# Altium schematic sheet AD.SchDoc
size A1
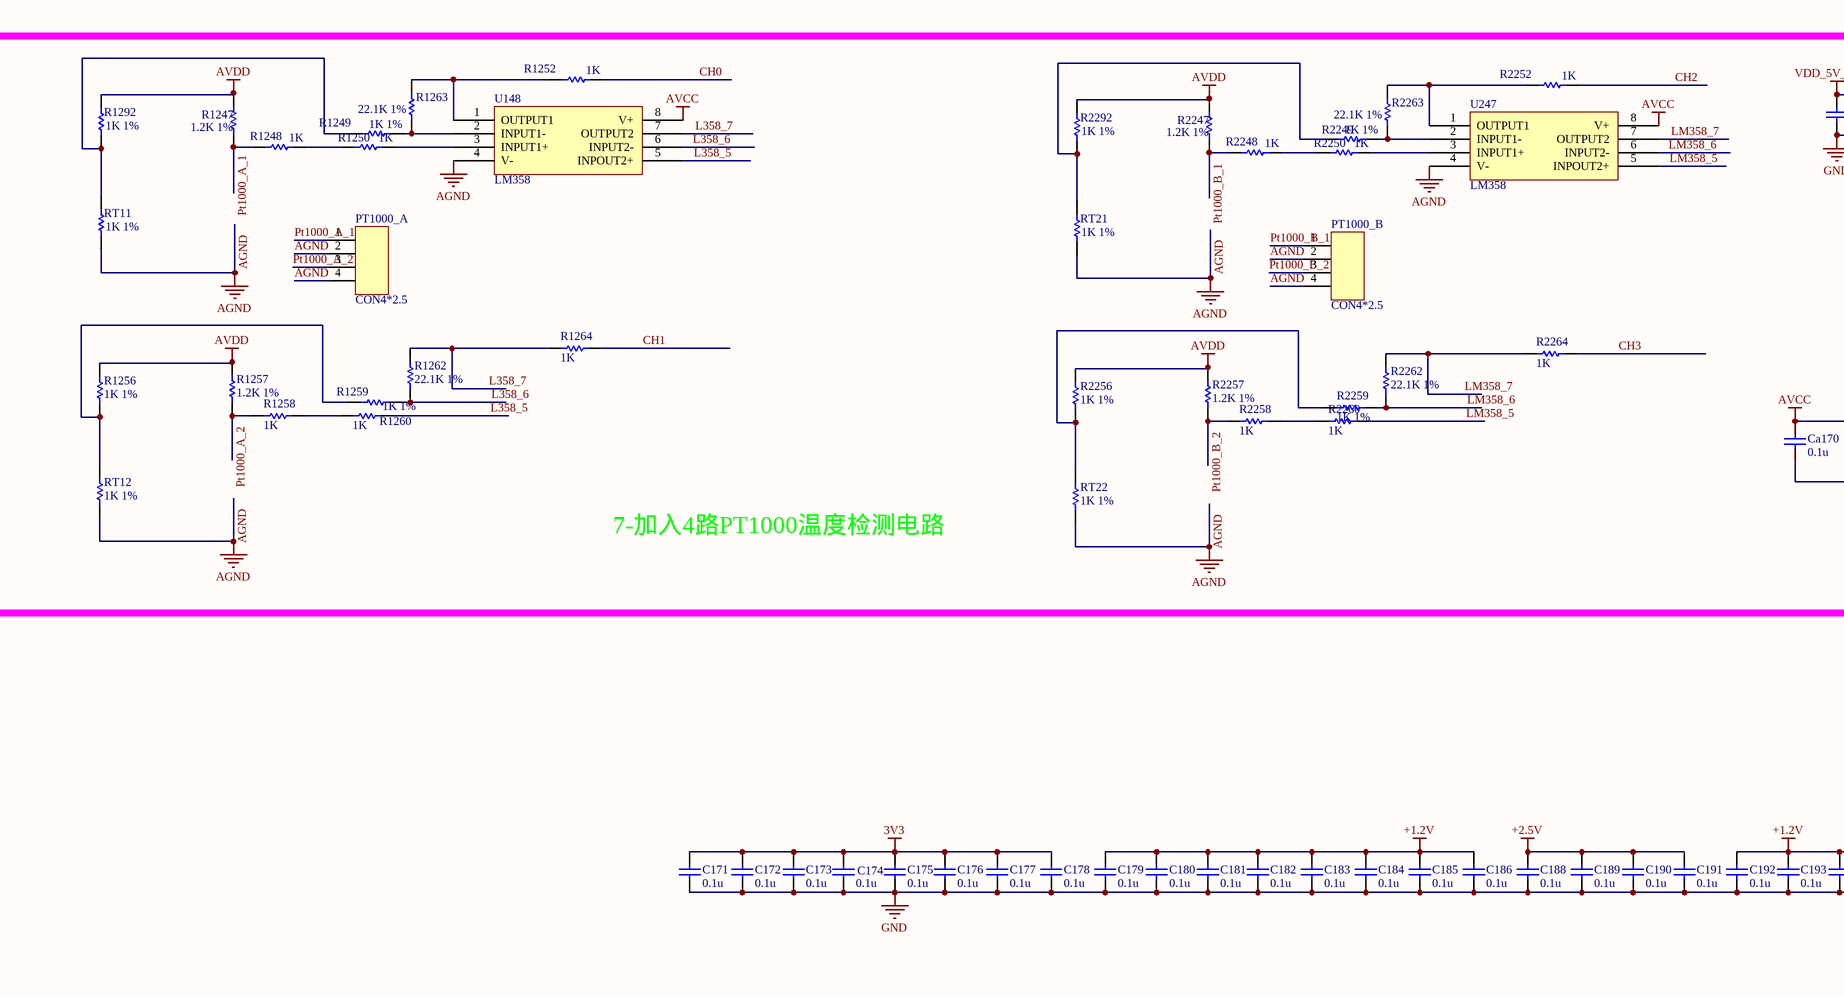
[diagram p0: AD.SchDoc, top left]
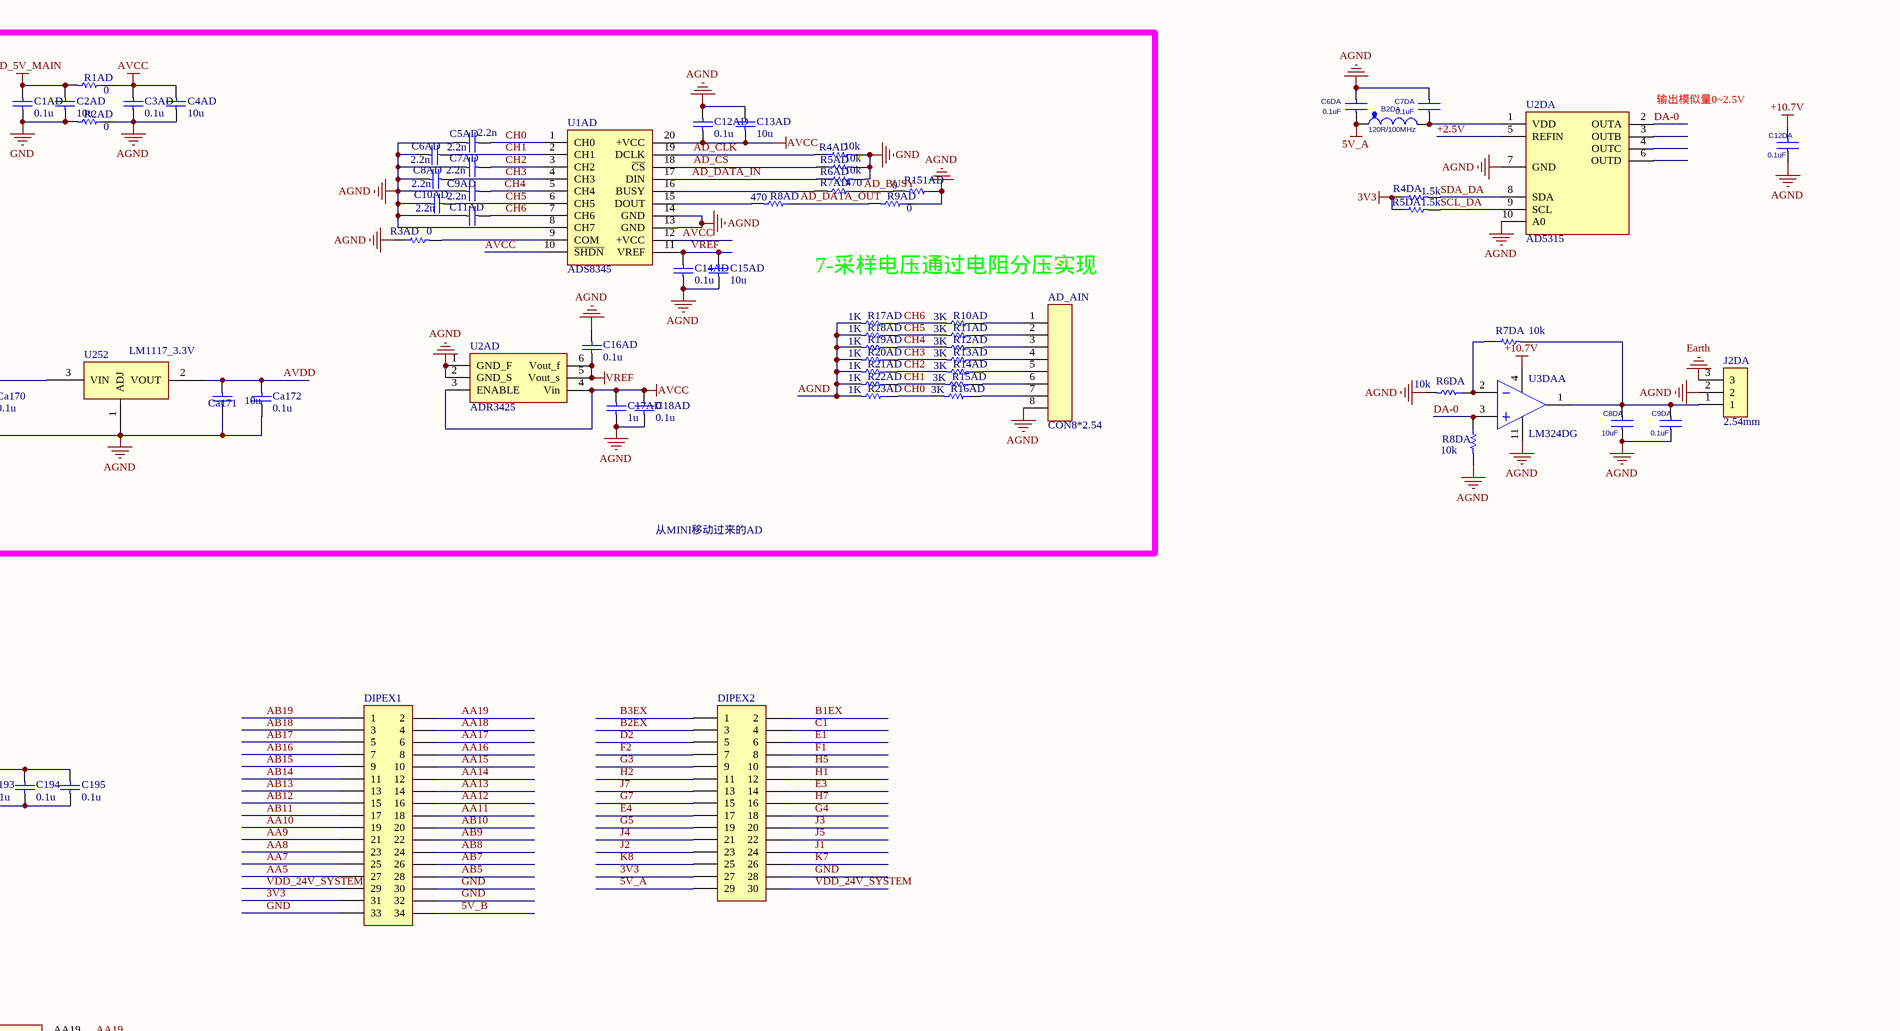
[diagram p1: AD.SchDoc, top right]
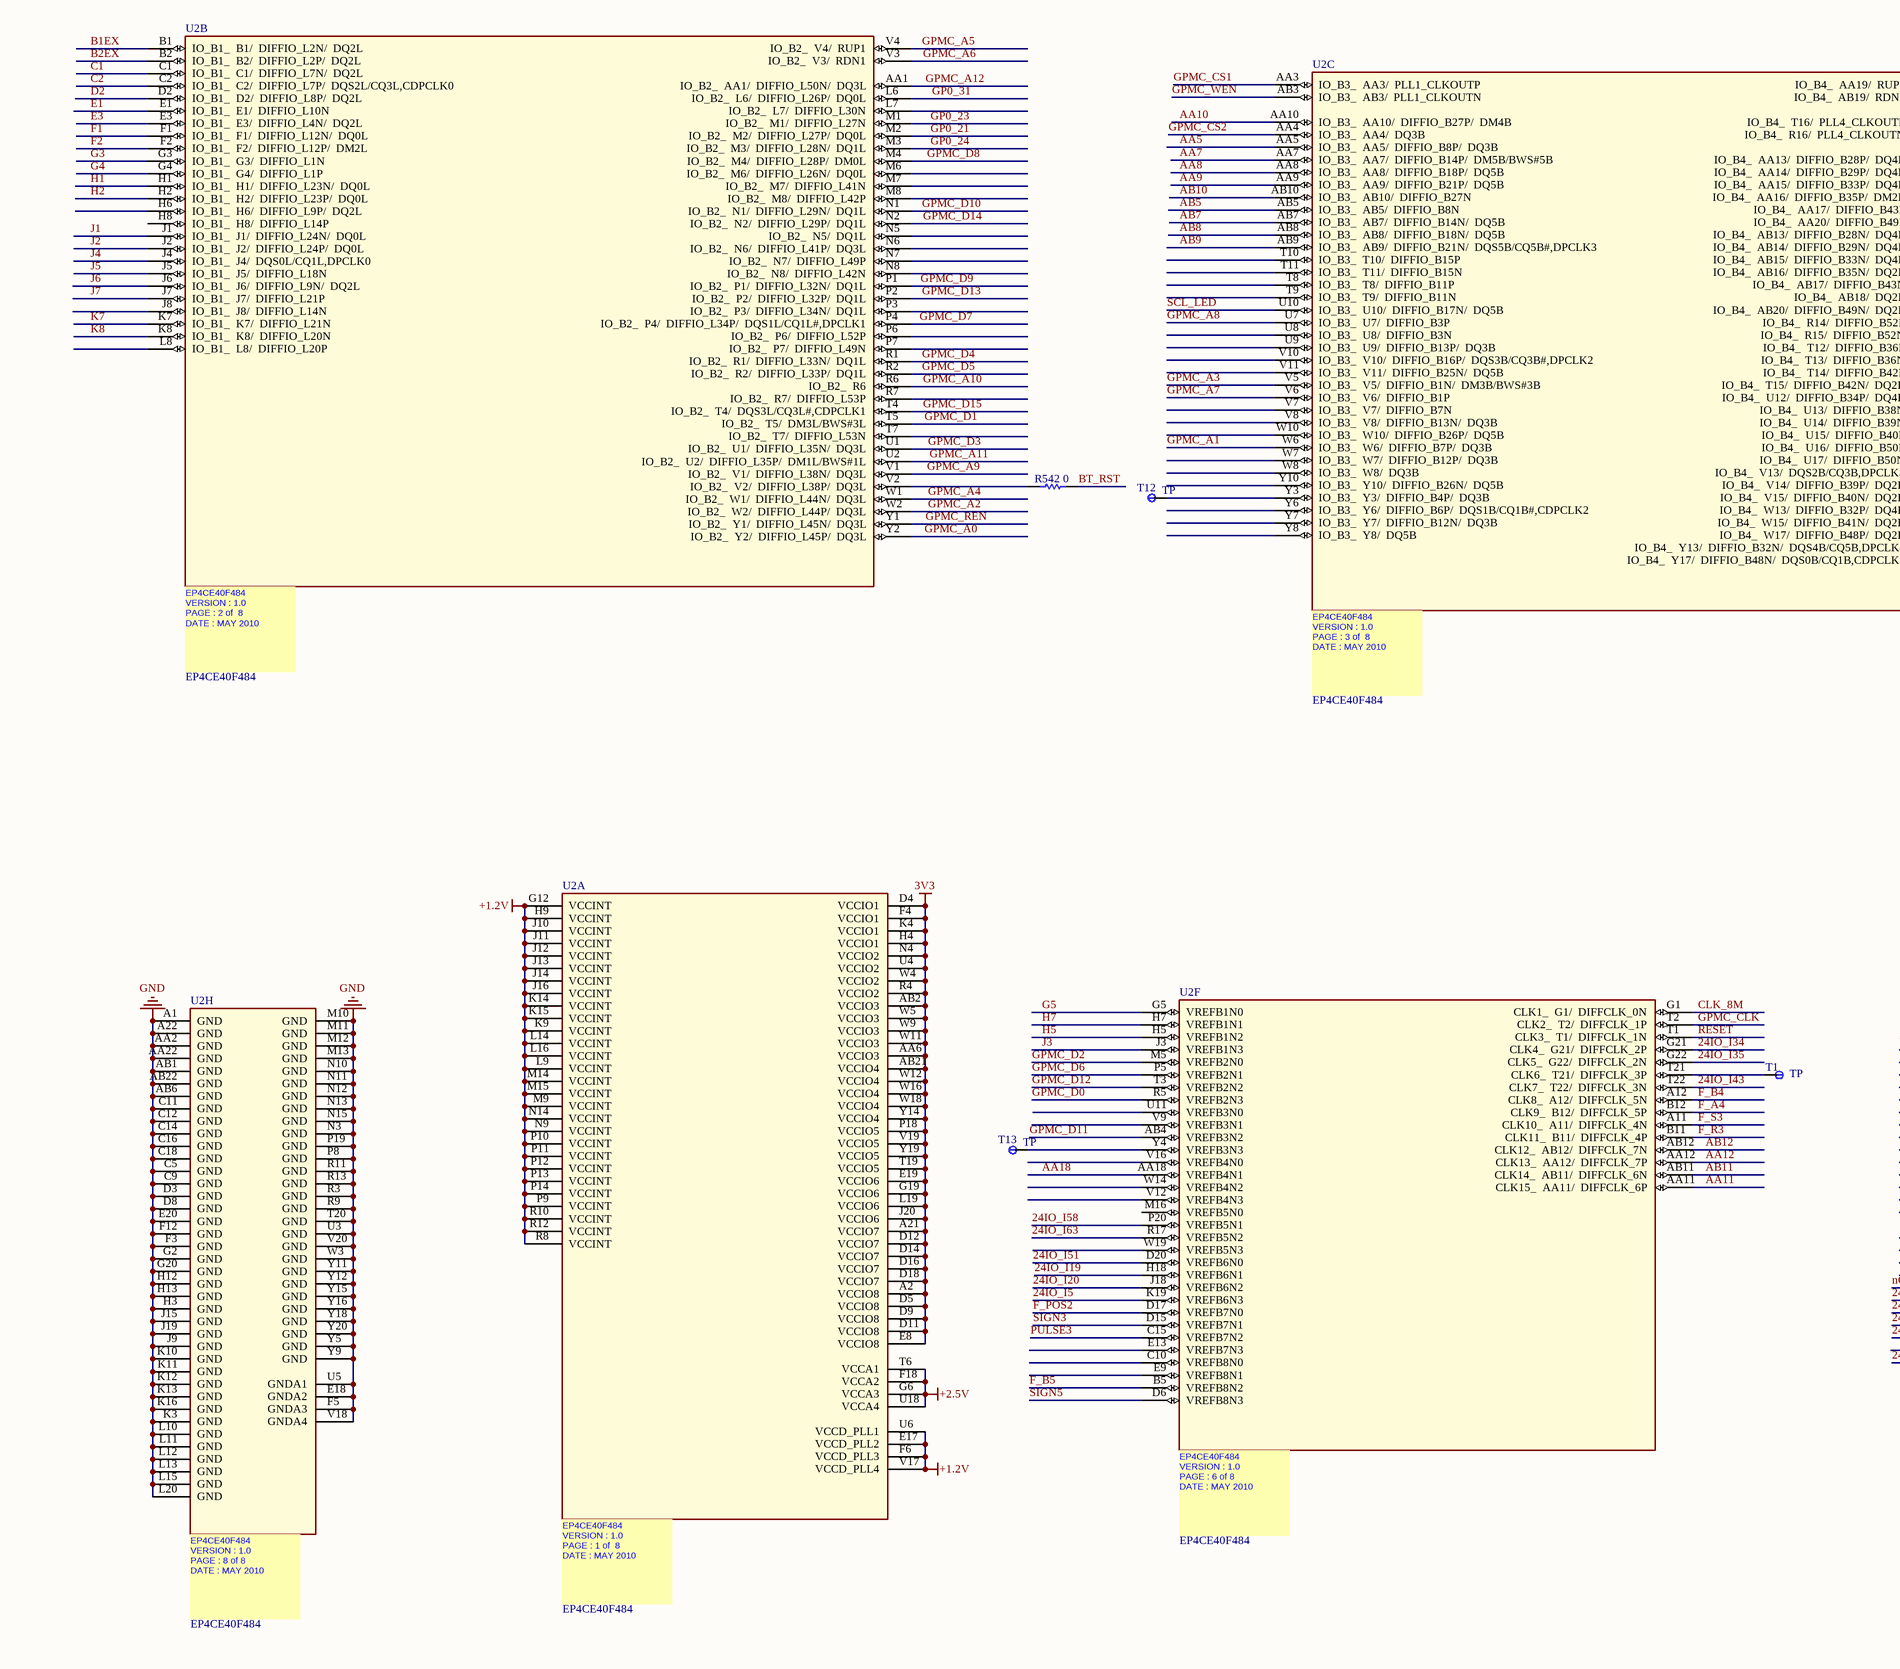
[diagram p2: AD.SchDoc, bottom left]
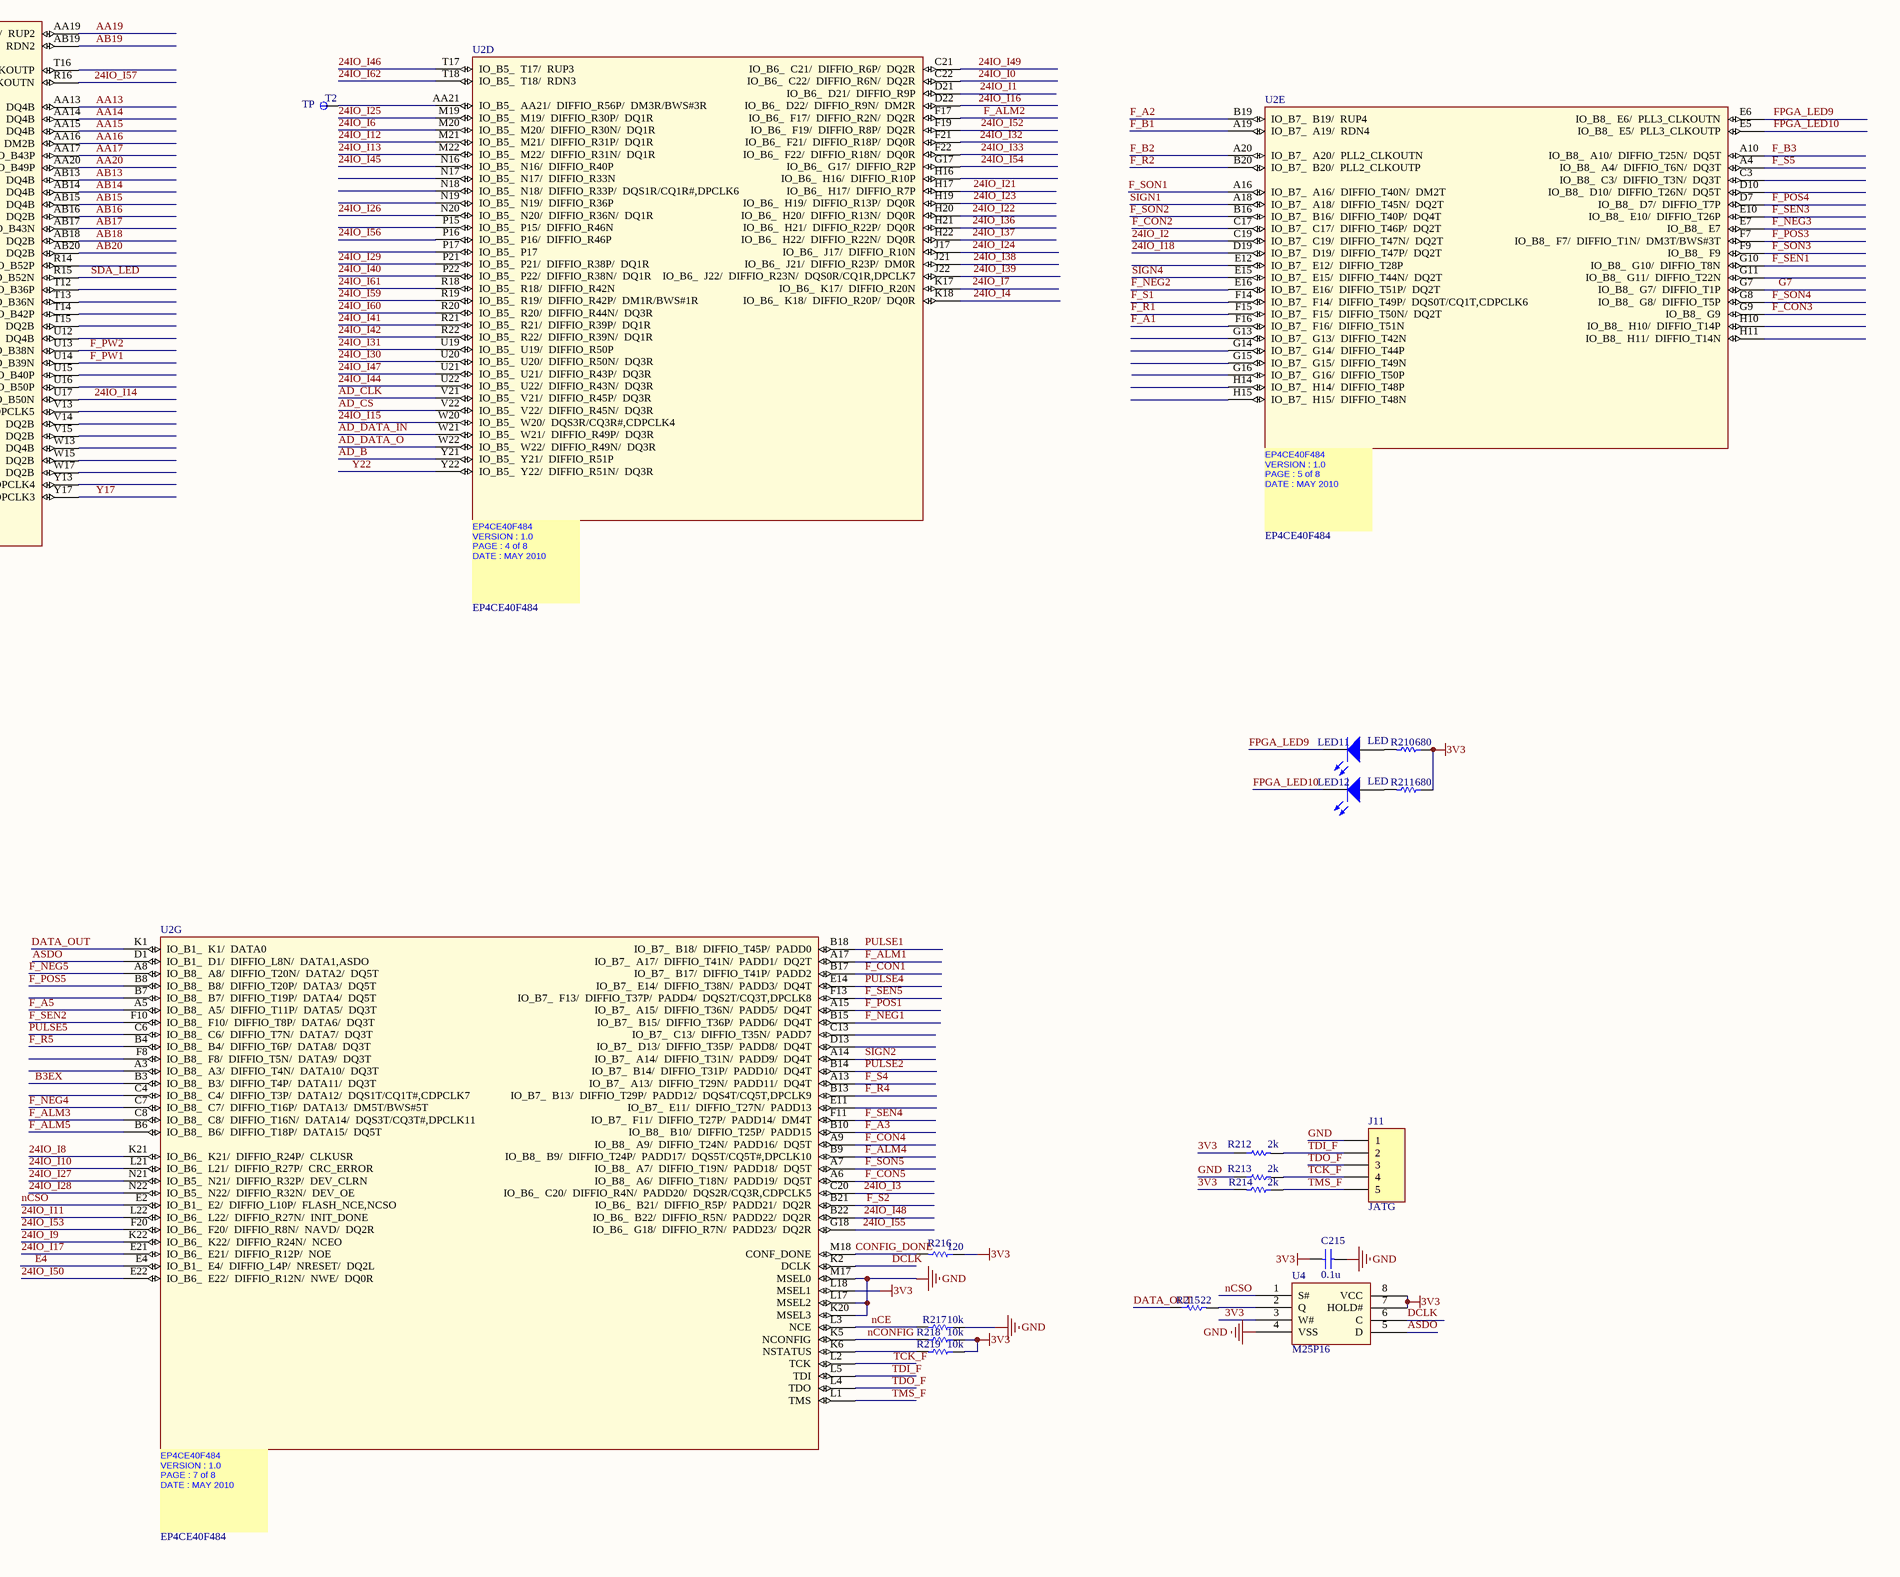
[diagram p3: AD.SchDoc, bottom right]

## Parts
AD_AIN  CON8*2.54  [CON2.54mm*8]
B2DA  120R/100MHz  [R0603]
C1AD  0.1u  [0402]
C2AD  10u  [C0805]
C3AD  0.1u  [0402]
C4AD  10u  [C0805]
C5AD  2.2n  [C0603]
C6AD  2.2n  [C0603]
C6DA  0.1uF  [C0603]
C7AD  2.2n  [C0603]
C7DA  0.1uF  [C0603]
C8AD  2.2n  [C0603]
C8DA  10uF  [C0805]
C9AD  2.2n  [C0603]
C9DA  0.1uF  [C0603]
C10AD  2.2n  [C0603]
C11AD  2.2n  [C0603]
C12AD  0.1u  [0402]
C12DA  0.1uF  [C0603]
C13AD  10u  [C0805]
C14AD  0.1u  [0402]
C15AD  10u  [C0805]
C16AD  0.1u  [0402]
C17AD  1u  [C0603]
C18AD  0.1u  [0402]
C171  0.1u  [C0402]
C172  0.1u  [C0402]
C173  0.1u  [C0402]
C174  0.1u  [C0402]
C175  0.1u  [C0402]
C176  0.1u  [C0402]
C177  0.1u  [C0402]
C178  0.1u  [C0402]
C179  0.1u  [C0402]
C180  0.1u  [C0402]
C181  0.1u  [C0402]
C182  0.1u  [C0402]
C183  0.1u  [C0402]
C184  0.1u  [C0402]
C185  0.1u  [C0402]
C186  0.1u  [C0402]
C188  0.1u  [C0402]
C189  0.1u  [C0402]
C190  0.1u  [C0402]
C191  0.1u  [C0402]
C192  0.1u  [C0402]
C193  0.1u  [C0402]
C194  0.1u  [C0402]
C195  0.1u  [C0402]
C215  0.1u  [C0402]
Ca170  0.1u  [C0603]
Ca171  10u  [C0805]
Ca172  0.1u  [C0603]
DIPEX1  (no value)  [HDR2X17]
DIPEX2  (no value)  [HDR2X15]
J2DA  2.54mm  [CON2.54MM*3]
J11  JATG  [MHDR1X5]
LED11  LED  [LED0603]
LED12  LED  [LED0603]
PT1000_A  CON4*2.5  [CON2.54MM*4]
PT1000_B  CON4*2.5  [CON2.54MM*4]
R1AD  0  [C0603]
R2AD  0  [C0603]
R3AD  0  [0402]
R4AD  10k  [0402]
R4DA  1.5k  [R0603]
R5AD  10k  [0402]
R5DA  1.5k  [R0603]
R6AD  10k  [0402]
R6DA  10k  [R0603]
R7AD  470  [0402]
R7DA  10k  [R0603]
R8AD  470  [0402]
R8DA  10k  [R0603]
R9AD  0  [R0603]
R10AD  3K  [0402]
R11AD  3K  [0402]
R12AD  3K  [0402]
R13AD  3K  [0402]
R14AD  3K  [0402]
R15AD  3K  [0402]
R16AD  3K  [0402]
R17AD  1K  [0402]
R18AD  1K  [0402]
R19AD  1K  [0402]
R20AD  1K  [0402]
R21AD  1K  [0402]
R22AD  1K  [0402]
R23AD  1K  [0402]
R151AD  0  [R0603]
R210  680  [R0603]
R211  680  [R0603]
R212  2k  [R0603]
R213  2k  [R0603]
R214  2k  [R0603]
R215  22  [R0603]
R216  120  [R0603]
R217  10k  [R0603]
R218  10k  [R0603]
R219  10k  [R0603]
R542  0  [R0603]
R1247  1.2K 1%  [R0603]
R1248  1K  [R0603]
R1249  1K 1%  [R0603]
R1250  1K  [R0603]
R1252  1K  [R0603]
R1256  1K 1%  [R0603]
R1257  1.2K 1%  [R0603]
R1258  1K  [R0603]
R1259  1K 1%  [R0603]
R1260  1K  [R0603]
R1262  22.1K 1%  [R0603]
R1263  22.1K 1%  [R0603]
R1264  1K  [R0603]
R1292  1K 1%  [R0603]
R2247  1.2K 1%  [R0603]
R2248  1K  [R0603]
R2249  1K 1%  [R0603]
R2250  1K  [R0603]
R2252  1K  [R0603]
R2256  1K 1%  [R0603]
R2257  1.2K 1%  [R0603]
R2258  1K  [R0603]
R2259  1K 1%  [R0603]
R2260  1K  [R0603]
R2262  22.1K 1%  [R0603]
R2263  22.1K 1%  [R0603]
R2264  1K  [R0603]
R2292  1K 1%  [R0603]
RT11  1K 1%  [R0603]
RT12  1K 1%  [R0603]
RT21  1K 1%  [R0603]
RT22  1K 1%  [R0603]
T1  TP  [TP]
T2  TP  [TP]
T12  TP  [TP]
T13  TP  [TP]
U1AD  ADS8345  [TSSOP20]
U2  EP4CE40F484  [F484]  (parts A,B,C,D,E,F,G,H of 8)
U2AD  ADR3425  [SOT-23-6]
U2DA  AD5315  [MSOP]
U3DA  LM324DG  [SO-14]  (part A of 4)
U4  M25P16  [SO-G8]
U148  LM358  [SO-G8]
U247  LM358  [SO-G8]
U252  LM1117_3.3V  [SOT223]

## Nets
3V3: C171.2 C172.2 C173.2 C174.2 C175.2 C176.2 C177.2 C178.2 C215.2 DIPEX1.31 DIPEX2.27 R4DA.1 R5DA.1 R210.1 R211.1 R212.1 R214.2 R216.1 R218.1 R219.1 U2.A2(VCCIO8) U2.A21(VCCIO7) U2.AA6(VCCIO3) U2.AB2(VCCIO3) U2.AB21(VCCIO4) U2.D4(VCCIO1) U2.D5(VCCIO8) U2.D9(VCCIO8) U2.D11(VCCIO8) U2.D12(VCCIO7) U2.D14(VCCIO7) U2.D16(VCCIO7) U2.D18(VCCIO7) U2.E8(VCCIO8) U2.E19(VCCIO6) U2.F4(VCCIO1) U2.G19(VCCIO6) U2.H4(VCCIO1) U2.J20(VCCIO6) U2.K4(VCCIO1) U2.L18(MSEL1) U2.L19(VCCIO6) U2.N4(VCCIO2) U2.P18(VCCIO5) U2.R4(VCCIO2) U2.T19(VCCIO5) U2.U4(VCCIO2) U2.V19(VCCIO5) U2.W4(VCCIO2) U2.W5(VCCIO3) U2.W9(VCCIO3) U2.W11(VCCIO3) U2.W12(VCCIO4) U2.W16(VCCIO4) U2.W18(VCCIO4) U2.Y14(VCCIO4) U2.Y19(VCCIO5) U4.3(W#) U4.7(HOLD#) U4.8(VCC)
5V_A: B2DA.1 C6DA.1 DIPEX2.29
+1.2V: C179.2 C180.2 C181.2 C182.2 C183.2 C184.2 C185.2 C186.2 C192.2 C193.2 C194.2 C195.2 U2.E17(VCCD_PLL2) U2.F6(VCCD_PLL3) U2.G12(VCCINT) U2.H9(VCCINT) U2.J10(VCCINT) U2.J11(VCCINT) U2.J12(VCCINT) U2.J13(VCCINT) U2.J14(VCCINT) U2.J16(VCCINT) U2.K9(VCCINT) U2.K14(VCCINT) U2.K15(VCCINT) U2.L9(VCCINT) U2.L14(VCCINT) U2.L16(VCCINT) U2.M9(VCCINT) U2.M14(VCCINT) U2.M15(VCCINT) U2.N9(VCCINT) U2.N14(VCCINT) U2.P9(VCCINT) U2.P10(VCCINT) U2.P11(VCCINT) U2.P12(VCCINT) U2.P13(VCCINT) U2.P14(VCCINT) U2.R8(VCCINT) U2.R10(VCCINT) U2.R12(VCCINT) U2.U6(VCCD_PLL1) U2.V17(VCCD_PLL4)
+2.5V: C188.2 C189.2 C190.2 C191.2 U2.F18(VCCA2) U2.G6(VCCA3) U2.T6(VCCA1) U2.U18(VCCA4) U2DA.5(REFIN)
+10.7V: C12DA.2 U3DA.4(VDD)
AGND: AD_AIN.8 C3AD.1 C4AD.1 C5AD.2 C6AD.2 C6DA.2 C7AD.2 C7DA.2 C8AD.2 C8DA.1 C9AD.2 C9DA.1 C10AD.2 C11AD.2 C12AD.2 C12DA.1 C13AD.2 C14AD.1 C15AD.1 C16AD.1 C17AD.2 C18AD.2 Ca170.1 Ca171.1 Ca172.1 J2DA.2 PT1000_A.2 PT1000_A.4 PT1000_B.2 PT1000_B.4 R2AD.1 R3AD.1 R6DA.2 R8DA.2 R9AD.1 R17AD.2 R18AD.2 R19AD.2 R20AD.2 R21AD.2 R22AD.2 R23AD.2 R151AD.1 RT11.2 RT12.2 RT21.2 RT22.2 U1AD.8(CH7) U1AD.13(GND) U1AD.14(GND) U2AD.1(GND_F) U2AD.2(GND_S) U2DA.7(GND) U2DA.10(A0) U3DA.11(GND) U148.4(V-) U247.4(V-) U252.1(ADJ)
AVCC: C3AD.2 C4AD.2 C12AD.1 C13AD.1 C17AD.1 C18AD.1 Ca170.2 R1AD.1 U1AD.10(~{SHDN}) U1AD.12(+VCC) U1AD.20(+VCC) U2AD.3(ENABLE) U2AD.4(Vin) U148.8(V+) U247.8(V+) U252.3(VIN)
AVDD: Ca171.2 Ca172.2 R1247.1 R1256.1 R1257.1 R1292.1 R2247.1 R2256.1 R2257.1 R2292.1 U252.2(VOUT)
Earth: J2DA.3
GND: C1AD.1 C2AD.1 C171.1 C172.1 C173.1 C174.1 C175.1 C176.1 C177.1 C178.1 C179.1 C180.1 C181.1 C182.1 C183.1 C184.1 C185.1 C186.1 C188.1 C189.1 C190.1 C191.1 C192.1 C193.1 C194.1 C195.1 C215.1 DIPEX1.30 DIPEX1.32 DIPEX1.33 DIPEX2.28 J11.1 R2AD.2 R4AD.2 R5AD.2 R6AD.2 R213.1 R217.1 U2.A1(GND) U2.A22(GND) U2.AA2(GND) U2.AA22(GND) U2.AB1(GND) U2.AB6(GND) U2.AB22(GND) U2.C5(GND) U2.C9(GND) U2.C11(GND) U2.C12(GND) U2.C14(GND) U2.C16(GND) U2.C18(GND) U2.D3(GND) U2.D8(GND) U2.E18(GNDA2) U2.E20(GND) U2.F3(GND) U2.F5(GNDA3) U2.F12(GND) U2.G2(GND) U2.G20(GND) U2.H3(GND) U2.H12(GND) U2.H13(GND) U2.J9(GND) U2.J15(GND) U2.J19(GND) U2.K3(GND) U2.K10(GND) U2.K11(GND) U2.K12(GND) U2.K13(GND) U2.K16(GND) U2.K20(MSEL3) U2.L10(GND) U2.L11(GND) U2.L12(GND) U2.L13(GND) U2.L15(GND) U2.L17(MSEL2) U2.L20(GND) U2.M10(GND) U2.M11(GND) U2.M12(GND) U2.M13(GND) U2.M17(MSEL0) U2.N3(GND) U2.N10(GND) U2.N11(GND) U2.N12(GND) U2.N13(GND) U2.N15(GND) U2.P8(GND) U2.P19(GND) U2.R3(GND) U2.R9(GND) U2.R11(GND) U2.R13(GND) U2.T20(GND) U2.U3(GND) U2.U5(GNDA1) U2.V18(GNDA4) U2.V20(GND) U2.W3(GND) U2.Y5(GND) U2.Y9(GND) U2.Y11(GND) U2.Y12(GND) U2.Y15(GND) U2.Y16(GND) U2.Y18(GND) U2.Y20(GND) U4.4(VSS)
VDD_5V_MAIN: C1AD.2 C2AD.2 R1AD.2
VREF: C14AD.2 C15AD.2 C16AD.2 U1AD.11(VREF) U2AD.5(Vout_s) U2AD.6(Vout_f)
5V_B: DIPEX1.34
24IO_I0: U2.C22(IO_B6___C22/__DIFFIO_R6N/__DQ2R)
24IO_I1: U2.D21(IO_B6___D21/__DIFFIO_R9P)
24IO_I2: U2.C19(IO_B7___C19/__DIFFIO_T47N/__DQ2T)
24IO_I3: U2.C20(IO_B6___C20/__DIFFIO_R4N/__PADD20/__DQS2R/CQ3R,CDPCLK5)
24IO_I4: U2.K18(IO_B6___K18/__DIFFIO_R20P/__DQ0R)
24IO_I5: U2.K19(VREFB6N3)
24IO_I6: U2.M20(IO_B5___M20/__DIFFIO_R30N/__DQ1R)
24IO_I7: U2.K17(IO_B6___K17/__DIFFIO_R20N)
24IO_I8: U2.K21(IO_B6___K21/__DIFFIO_R24P/__CLKUSR)
24IO_I9: U2.K22(IO_B6___K22/__DIFFIO_R24N/__NCEO)
24IO_I10: U2.L21(IO_B6___L21/__DIFFIO_R27P/__CRC_ERROR)
24IO_I11: U2.L22(IO_B6___L22/__DIFFIO_R27N/__INIT_DONE)
24IO_I12: U2.M21(IO_B5___M21/__DIFFIO_R31P/__DQ1R)
24IO_I13: U2.M22(IO_B5___M22/__DIFFIO_R31N/__DQ1R)
24IO_I14: U2.U17(IO_B4___U17/__DIFFIO_B50N)
24IO_I15: U2.W20(IO_B5___W20/__DQS3R/CQ3R#,CDPCLK4)
24IO_I16: U2.D22(IO_B6___D22/__DIFFIO_R9N/__DM2R)
24IO_I17: U2.E21(IO_B6___E21/__DIFFIO_R12P/__NOE)
24IO_I18: U2.D19(IO_B7___D19/__DIFFIO_T47P/__DQ2T)
24IO_I19: U2.H18(VREFB6N1)
24IO_I20: U2.J18(VREFB6N2)
24IO_I21: U2.H17(IO_B6___H17/__DIFFIO_R7P)
24IO_I22: U2.H20(IO_B6___H20/__DIFFIO_R13N/__DQ0R)
24IO_I23: U2.H19(IO_B6___H19/__DIFFIO_R13P/__DQ0R)
24IO_I24: U2.J17(IO_B6___J17/__DIFFIO_R10N)
24IO_I25: U2.M19(IO_B5___M19/__DIFFIO_R30P/__DQ1R)
24IO_I26: U2.N20(IO_B5___N20/__DIFFIO_R36N/__DQ1R)
24IO_I27: U2.N21(IO_B5___N21/__DIFFIO_R32P/__DEV_CLRN)
24IO_I28: U2.N22(IO_B5___N22/__DIFFIO_R32N/__DEV_OE)
24IO_I29: U2.P21(IO_B5___P21/__DIFFIO_R38P/__DQ1R)
24IO_I30: U2.U20(IO_B5___U20/__DIFFIO_R50N/__DQ3R)
24IO_I31: U2.U19(IO_B5___U19/__DIFFIO_R50P)
24IO_I32: U2.F21(IO_B6___F21/__DIFFIO_R18P/__DQ0R)
24IO_I33: U2.F22(IO_B6___F22/__DIFFIO_R18N/__DQ0R)
24IO_I34: U2.G21(CLK4___G21/__DIFFCLK_2P)
24IO_I35: U2.G22(CLK5___G22/__DIFFCLK_2N)
24IO_I36: U2.H21(IO_B6___H21/__DIFFIO_R22P/__DQ0R)
24IO_I37: U2.H22(IO_B6___H22/__DIFFIO_R22N/__DQ0R)
24IO_I38: U2.J21(IO_B6___J21/__DIFFIO_R23P/__DM0R)
24IO_I39: U2.J22(IO_B6___J22/__DIFFIO_R23N/__DQS0R/CQ1R,DPCLK7)
24IO_I40: U2.P22(IO_B5___P22/__DIFFIO_R38N/__DQ1R)
24IO_I41: U2.R21(IO_B5___R21/__DIFFIO_R39P/__DQ1R)
24IO_I42: U2.R22(IO_B5___R22/__DIFFIO_R39N/__DQ1R)
24IO_I43: U2.T22(CLK7___T22/__DIFFCLK_3N)
24IO_I44: U2.U22(IO_B5___U22/__DIFFIO_R43N/__DQ3R)
24IO_I45: U2.N16(IO_B5___N16/__DIFFIO_R40P)
24IO_I46: U2.T17(IO_B5___T17/__RUP3)
24IO_I47: U2.U21(IO_B5___U21/__DIFFIO_R43P/__DQ3R)
24IO_I48: U2.B22(IO_B6___B22/__DIFFIO_R5N/__PADD22/__DQ2R)
24IO_I49: U2.C21(IO_B6___C21/__DIFFIO_R6P/__DQ2R)
24IO_I50: U2.E22(IO_B6___E22/__DIFFIO_R12N/__NWE/__DQ0R)
24IO_I51: U2.D20(VREFB6N0)
24IO_I52: U2.F19(IO_B6___F19/__DIFFIO_R8P/__DQ2R)
24IO_I53: U2.F20(IO_B6___F20/__DIFFIO_R8N/__NAVD/__DQ2R)
24IO_I54: U2.G17(IO_B6___G17/__DIFFIO_R2P)
24IO_I55: U2.G18(IO_B6___G18/__DIFFIO_R7N/__PADD23/__DQ2R)
24IO_I56: U2.P16(IO_B5___P16/__DIFFIO_R46P)
24IO_I57: U2.R16(IO_B4___R16/__PLL4_CLKOUTN)
24IO_I58: U2.P20(VREFB5N1)
24IO_I59: U2.R19(IO_B5___R19/__DIFFIO_R42P/__DM1R/BWS#1R)
24IO_I60: U2.R20(IO_B5___R20/__DIFFIO_R44N/__DQ3R)
24IO_I61: U2.R18(IO_B5___R18/__DIFFIO_R42N)
24IO_I62: U2.T18(IO_B5___T18/__RDN3)
24IO_I63: U2.R17(VREFB5N2)
AA5: DIPEX1.27 U2.AA5(IO_B3___AA5/__DIFFIO_B8P/__DQ3B)
AA7: DIPEX1.25 U2.AA7(IO_B3___AA7/__DIFFIO_B14P/__DM5B/BWS#5B)
AA8: DIPEX1.23 U2.AA8(IO_B3___AA8/__DIFFIO_B18P/__DQ5B)
AA9: DIPEX1.21 U2.AA9(IO_B3___AA9/__DIFFIO_B21P/__DQ5B)
AA10: DIPEX1.19 U2.AA10(IO_B3___AA10/__DIFFIO_B27P/__DM4B)
AA11: DIPEX1.18 U2.AA11(CLK15___AA11/__DIFFCLK_6P)
AA12: DIPEX1.16 U2.AA12(CLK13___AA12/__DIFFCLK_7P)
AA13: DIPEX1.14 U2.AA13(IO_B4___AA13/__DIFFIO_B28P/__DQ4B)
AA14: DIPEX1.12 U2.AA14(IO_B4___AA14/__DIFFIO_B29P/__DQ4B)
AA15: DIPEX1.10 U2.AA15(IO_B4___AA15/__DIFFIO_B33P/__DQ4B)
AA16: DIPEX1.8 U2.AA16(IO_B4___AA16/__DIFFIO_B35P/__DM2B)
AA17: DIPEX1.6 U2.AA17(IO_B4___AA17/__DIFFIO_B43P)
AA18: DIPEX1.4 U2.AA18(VREFB4N1)
AA19: DIPEX1.2 U2.AA19(IO_B4___AA19/__RUP2)
AA20: U2.AA20(IO_B4___AA20/__DIFFIO_B49P)
AB5: DIPEX1.28 U2.AB5(IO_B3___AB5/__DIFFIO_B8N)
AB7: DIPEX1.26 U2.AB7(IO_B3___AB7/__DIFFIO_B14N/__DQ5B)
AB8: DIPEX1.24 U2.AB8(IO_B3___AB8/__DIFFIO_B18N/__DQ5B)
AB9: DIPEX1.22 U2.AB9(IO_B3___AB9/__DIFFIO_B21N/__DQS5B/CQ5B#,DPCLK3)
AB10: DIPEX1.20 U2.AB10(IO_B3___AB10/__DIFFIO_B27N)
AB11: DIPEX1.17 U2.AB11(CLK14___AB11/__DIFFCLK_6N)
AB12: DIPEX1.15 U2.AB12(CLK12___AB12/__DIFFCLK_7N)
AB13: DIPEX1.13 U2.AB13(IO_B4___AB13/__DIFFIO_B28N/__DQ4B)
AB14: DIPEX1.11 U2.AB14(IO_B4___AB14/__DIFFIO_B29N/__DQ4B)
AB15: DIPEX1.9 U2.AB15(IO_B4___AB15/__DIFFIO_B33N/__DQ4B)
AB16: DIPEX1.7 U2.AB16(IO_B4___AB16/__DIFFIO_B35N/__DQ2B)
AB17: DIPEX1.5 U2.AB17(IO_B4___AB17/__DIFFIO_B43N)
AB18: DIPEX1.3 U2.AB18(IO_B4___AB18/__DQ2B)
AB19: DIPEX1.1 U2.AB19(IO_B4___AB19/__RDN2)
AB20: U2.AB20(IO_B4___AB20/__DIFFIO_B49N/__DQ2B)
AD_B: U2.Y21(IO_B5___Y21/__DIFFIO_R51P)
AD_BUSY: R7AD.1 R151AD.2
AD_CLK: R4AD.1 U1AD.19(DCLK) U2.V21(IO_B5___V21/__DIFFIO_R45P/__DQ3R)
AD_CS: R5AD.1 U1AD.18(~{CS}) U2.V22(IO_B5___V22/__DIFFIO_R45N/__DQ3R)
AD_DATA_IN: R6AD.1 U1AD.17(DIN) U2.W21(IO_B5___W21/__DIFFIO_R49P/__DQ3R)
AD_DATA_O: U2.W22(IO_B5___W22/__DIFFIO_R49N/__DQ3R)
AD_DATA_OUT: R8AD.1 R9AD.2
ASDO: U2.D1(IO_B1___D1/__DIFFIO_L8N/__DATA1,ASDO) U4.5(D)
B1EX: DIPEX2.2 U2.B1(IO_B1___B1/__DIFFIO_L2N/__DQ2L)
B2EX: DIPEX2.3 U2.B2(IO_B1___B2/__DIFFIO_L2P/__DQ2L)
B3EX: DIPEX2.1 U2.B3(IO_B8___B3/__DIFFIO_T4P/__DATA11/__DQ3T)
BT_RST: R542.2
C1: DIPEX2.4 U2.C1(IO_B1___C1/__DIFFIO_L7N/__DQ2L)
C2: U2.C2(IO_B1___C2/__DIFFIO_L7P/__DQS2L/CQ3L,CDPCLK0)
CH0: C5AD.1 R16AD.2 R23AD.1 R1252.2 U1AD.1(CH0)
CH1: C6AD.1 R15AD.2 R22AD.1 R1264.2 U1AD.2(CH1)
CH2: C7AD.1 R14AD.2 R21AD.1 R2252.2 U1AD.3(CH2)
CH3: C8AD.1 R13AD.2 R20AD.1 R2264.2 U1AD.4(CH3)
CH4: C9AD.1 R12AD.2 R19AD.1 U1AD.5(CH4)
CH5: C10AD.1 R11AD.2 R18AD.1 U1AD.6(CH5)
CH6: C11AD.1 R10AD.2 R17AD.1 U1AD.7(CH6)
CLK_8M: U2.G1(CLK1___G1/__DIFFCLK_0N)
CONFIG_DONE: R216.2 U2.M18(CONF_DONE)
D2: DIPEX2.5 U2.D2(IO_B1___D2/__DIFFIO_L8P/__DQ2L)
DA-0: R8DA.1 U2DA.2(OUTA) U3DA.3
DATA_OUT: R215.1 U2.K1(IO_B1___K1/__DATA0)
DCLK: U2.K2(DCLK) U4.6(C)
E1: DIPEX2.6 U2.E1(IO_B1___E1/__DIFFIO_L10N)
E3: DIPEX2.14 U2.E3(IO_B1___E3/__DIFFIO_L4N/__DQ2L)
E4: DIPEX2.17 U2.E4(IO_B1___E4/__DIFFIO_L4P/__NRESET/__DQ2L)
F1: DIPEX2.8 U2.F1(IO_B1___F1/__DIFFIO_L12N/__DQ0L)
F2: DIPEX2.7 U2.F2(IO_B1___F2/__DIFFIO_L12P/__DM2L)
F_A1: U2.F16(IO_B7___F16/__DIFFIO_T51N)
F_A2: U2.B19(IO_B7___B19/__RUP4)
F_A3: U2.B10(IO_B8___B10/__DIFFIO_T25P/__PADD15)
F_A4: U2.B12(CLK9___B12/__DIFFCLK_5P)
F_A5: U2.A5(IO_B8___A5/__DIFFIO_T11P/__DATA5/__DQ3T)
F_ALM1: U2.A17(IO_B7___A17/__DIFFIO_T41N/__PADD1/__DQ2T)
F_ALM2: U2.F17(IO_B6___F17/__DIFFIO_R2N/__DQ2R)
F_ALM3: U2.C8(IO_B8___C8/__DIFFIO_T16N/__DATA14/__DQS3T/CQ3T#,DPCLK11)
F_ALM4: U2.B9(IO_B8___B9/__DIFFIO_T24P/__PADD17/__DQS5T/CQ5T#,DPCLK10)
F_ALM5: U2.B6(IO_B8___B6/__DIFFIO_T18P/__DATA15/__DQ5T)
F_B1: U2.A19(IO_B7___A19/__RDN4)
F_B2: U2.A20(IO_B7___A20/__PLL2_CLKOUTN)
F_B3: U2.A10(IO_B8___A10/__DIFFIO_T25N/__DQ5T)
F_B4: U2.A12(CLK8___A12/__DIFFCLK_5N)
F_B5: U2.B5(VREFB8N2)
F_CON1: U2.B17(IO_B7___B17/__DIFFIO_T41P/__PADD2)
F_CON2: U2.C17(IO_B7___C17/__DIFFIO_T46P/__DQ2T)
F_CON3: U2.G9(IO_B8___G9)
F_CON4: U2.A9(IO_B8___A9/__DIFFIO_T24N/__PADD16/__DQ5T)
F_CON5: U2.A6(IO_B8___A6/__DIFFIO_T18N/__PADD19/__DQ5T)
F_NEG1: U2.B15(IO_B7___B15/__DIFFIO_T36P/__PADD6/__DQ4T)
F_NEG2: U2.E16(IO_B7___E16/__DIFFIO_T51P/__DQ2T)
F_NEG3: U2.E7(IO_B8___E7)
F_NEG4: U2.C7(IO_B8___C7/__DIFFIO_T16P/__DATA13/__DM5T/BWS#5T)
F_NEG5: U2.A8(IO_B8___A8/__DIFFIO_T20N/__DATA2/__DQ5T)
F_POS1: U2.A15(IO_B7___A15/__DIFFIO_T36N/__PADD5/__DQ4T)
F_POS2: U2.D17(VREFB7N0)
F_POS3: U2.F7(IO_B8___F7/__DIFFIO_T1N/__DM3T/BWS#3T)
F_POS4: U2.D7(IO_B8___D7/__DIFFIO_T7P)
F_POS5: U2.B8(IO_B8___B8/__DIFFIO_T20P/__DATA3/__DQ5T)
F_PW1: U2.U14(IO_B4___U14/__DIFFIO_B39N)
F_PW2: U2.U13(IO_B4___U13/__DIFFIO_B38N)
F_R1: U2.F15(IO_B7___F15/__DIFFIO_T50N/__DQ2T)
F_R2: U2.B20(IO_B7___B20/__PLL2_CLKOUTP)
F_R3: U2.B11(CLK11___B11/__DIFFCLK_4P)
F_R4: U2.B13(IO_B7___B13/__DIFFIO_T29P/__PADD12/__DQS4T/CQ5T,DPCLK9)
F_R5: U2.B4(IO_B8___B4/__DIFFIO_T6P/__DATA8/__DQ3T)
F_S1: U2.F14(IO_B7___F14/__DIFFIO_T49P/__DQS0T/CQ1T,CDPCLK6)
F_S2: U2.B21(IO_B6___B21/__DIFFIO_R5P/__PADD21/__DQ2R)
F_S3: U2.A11(CLK10___A11/__DIFFCLK_4N)
F_S4: U2.A13(IO_B7___A13/__DIFFIO_T29N/__PADD11/__DQ4T)
F_S5: U2.A4(IO_B8___A4/__DIFFIO_T6N/__DQ3T)
F_SEN1: U2.G10(IO_B8___G10/__DIFFIO_T8N)
F_SEN2: U2.F10(IO_B8___F10/__DIFFIO_T8P/__DATA6/__DQ3T)
F_SEN3: U2.E10(IO_B8___E10/__DIFFIO_T26P)
F_SEN4: U2.F11(IO_B7___F11/__DIFFIO_T27P/__PADD14/__DM4T)
F_SEN5: U2.F13(IO_B7___F13/__DIFFIO_T37P/__PADD4/__DQS2T/CQ3T,DPCLK8)
F_SON1: U2.A16(IO_B7___A16/__DIFFIO_T40N/__DM2T)
F_SON2: U2.B16(IO_B7___B16/__DIFFIO_T40P/__DQ4T)
F_SON3: U2.F9(IO_B8___F9)
F_SON4: U2.G8(IO_B8___G8/__DIFFIO_T5P)
F_SON5: U2.A7(IO_B8___A7/__DIFFIO_T19N/__PADD18/__DQ5T)
FPGA_LED9: LED11.2(K) U2.E6(IO_B8___E6/__PLL3_CLKOUTN)
FPGA_LED10: LED12.2(K) U2.E5(IO_B8___E5/__PLL3_CLKOUTP)
G3: DIPEX2.9 U2.G3(IO_B1___G3/__DIFFIO_L1N)
G4: DIPEX2.18 U2.G4(IO_B1___G4/__DIFFIO_L1P)
G5: DIPEX2.19 U2.G5(VREFB1N0)
G7: DIPEX2.15 U2.G7(IO_B8___G7/__DIFFIO_T1P)
GP0_21: U2.M2(IO_B2___M2/__DIFFIO_L27P/__DQ0L)
GP0_23: U2.M1(IO_B2___M1/__DIFFIO_L27N)
GP0_24: U2.M3(IO_B2___M3/__DIFFIO_L28N/__DQ1L)
GP0_31: U2.L6(IO_B2___L6/__DIFFIO_L26P/__DQ0L)
GPMC_A0: U2.Y2(IO_B2___Y2/__DIFFIO_L45P/__DQ3L)
GPMC_A1: U2.W6(IO_B3___W6/__DIFFIO_B7P/__DQ3B)
GPMC_A2: U2.W2(IO_B2___W2/__DIFFIO_L44P/__DQ3L)
GPMC_A3: U2.V5(IO_B3___V5/__DIFFIO_B1N/__DM3B/BWS#3B)
GPMC_A4: U2.W1(IO_B2___W1/__DIFFIO_L44N/__DQ3L)
GPMC_A5: U2.V4(IO_B2___V4/__RUP1)
GPMC_A6: U2.V3(IO_B2___V3/__RDN1)
GPMC_A7: U2.V6(IO_B3___V6/__DIFFIO_B1P)
GPMC_A8: U2.U7(IO_B3___U7/__DIFFIO_B3P)
GPMC_A9: U2.V1(IO_B2___V1/__DIFFIO_L38N/__DQ3L)
GPMC_A10: U2.R6(IO_B2___R6)
GPMC_A11: U2.U2(IO_B2___U2/__DIFFIO_L35P/__DM1L/BWS#1L)
GPMC_A12: U2.AA1(IO_B2___AA1/__DIFFIO_L50N/__DQ3L)
GPMC_CLK: U2.T2(CLK2___T2/__DIFFCLK_1P)
GPMC_CS1: U2.AA3(IO_B3___AA3/__PLL1_CLKOUTP)
GPMC_CS2: U2.AA4(IO_B3___AA4/__DQ3B)
GPMC_D0: U2.R5(VREFB2N3)
GPMC_D1: U2.T5(IO_B2___T5/__DM3L/BWS#3L)
GPMC_D2: U2.M5(VREFB2N0)
GPMC_D3: U2.U1(IO_B2___U1/__DIFFIO_L35N/__DQ3L)
GPMC_D4: U2.R1(IO_B2___R1/__DIFFIO_L33N/__DQ1L)
GPMC_D5: U2.R2(IO_B2___R2/__DIFFIO_L33P/__DQ1L)
GPMC_D6: U2.P5(VREFB2N1)
GPMC_D7: U2.P4(IO_B2___P4/__DIFFIO_L34P/__DQS1L/CQ1L#,DPCLK1)
GPMC_D8: U2.M4(IO_B2___M4/__DIFFIO_L28P/__DM0L)
GPMC_D9: U2.P1(IO_B2___P1/__DIFFIO_L32N/__DQ1L)
GPMC_D10: U2.N1(IO_B2___N1/__DIFFIO_L29N/__DQ1L)
GPMC_D11: U2.AB4(VREFB3N2)
GPMC_D12: U2.T3(VREFB2N2)
GPMC_D13: U2.P2(IO_B2___P2/__DIFFIO_L32P/__DQ1L)
GPMC_D14: U2.N2(IO_B2___N2/__DIFFIO_L29P/__DQ1L)
GPMC_D15: U2.T4(IO_B2___T4/__DQS3L/CQ3L#,CDPCLK1)
GPMC_REN: U2.Y1(IO_B2___Y1/__DIFFIO_L45N/__DQ3L)
GPMC_WEN: U2.AB3(IO_B3___AB3/__PLL1_CLKOUTN)
H1: DIPEX2.12 U2.H1(IO_B1___H1/__DIFFIO_L23N/__DQ0L)
H2: DIPEX2.11 U2.H2(IO_B1___H2/__DIFFIO_L23P/__DQ0L)
H5: DIPEX2.10 U2.H5(VREFB1N2)
H7: DIPEX2.16 U2.H7(VREFB1N1)
J1: DIPEX2.24 U2.J1(IO_B1___J1/__DIFFIO_L24N/__DQ0L)
J2: DIPEX2.23 U2.J2(IO_B1___J2/__DIFFIO_L24P/__DQ0L)
J3: DIPEX2.20 U2.J3(VREFB1N3)
J4: DIPEX2.21 U2.J4(IO_B1___J4/__DQS0L/CQ1L,DPCLK0)
J5: DIPEX2.22 U2.J5(IO_B1___J5/__DIFFIO_L18N)
J6: U2.J6(IO_B1___J6/__DIFFIO_L9N/__DQ2L)
J7: DIPEX2.13 U2.J7(IO_B1___J7/__DIFFIO_L21P)
K7: DIPEX2.26 U2.K7(IO_B1___K7/__DIFFIO_L21N)
K8: DIPEX2.25 U2.K8(IO_B1___K8/__DIFFIO_L20N)
L358_5: R1260.2 U148.5(INPOUT2+)
L358_6: R1259.2 R1262.1 U148.6(INPUT2-)
L358_7: R1262.2 R1264.1 U148.7(OUTPUT2)
LM358_5: R2260.2 U247.5(INPOUT2+)
LM358_6: R2259.2 R2262.1 U247.6(INPUT2-)
LM358_7: R2262.2 R2264.1 U247.7(OUTPUT2)
nCE: R217.2 U2.L3(NCE)
nCONFIG: R218.2 U2.K5(NCONFIG)
nCSO: U2.E2(IO_B1___E2/__DIFFIO_L10P/__FLASH_NCE,NCSO) U4.1(S#)
Pt1000_A_1: PT1000_A.1 R1247.2 R1248.1
Pt1000_A_2: PT1000_A.3 R1257.2 R1258.1
Pt1000_B_1: PT1000_B.1 R2247.2 R2248.1
Pt1000_B_2: PT1000_B.3 R2257.2 R2258.1
PULSE1: U2.B18(IO_B7___B18/__DIFFIO_T45P/__PADD0)
PULSE2: U2.B14(IO_B7___B14/__DIFFIO_T31P/__PADD10/__DQ4T)
PULSE3: U2.C15(VREFB7N2)
PULSE4: U2.E14(IO_B7___E14/__DIFFIO_T38N/__PADD3/__DQ4T)
PULSE5: U2.C6(IO_B8___C6/__DIFFIO_T7N/__DATA7/__DQ3T)
~{RESET}: U2.T1(CLK3___T1/__DIFFCLK_1N)
SCL_DA: R5DA.2 U2DA.9(SCL)
SCL_LED: U2.U10(IO_B3___U10/__DIFFIO_B17N/__DQ5B)
SDA_DA: R4DA.2 U2DA.8(SDA)
SDA_LED: U2.R15(IO_B4___R15/__DIFFIO_B52N)
SIGN1: U2.A18(IO_B7___A18/__DIFFIO_T45N/__DQ2T)
SIGN2: U2.A14(IO_B7___A14/__DIFFIO_T31N/__PADD9/__DQ4T)
SIGN3: U2.D15(VREFB7N1)
SIGN4: U2.E15(IO_B7___E15/__DIFFIO_T44N/__DQ2T)
SIGN5: U2.D6(VREFB8N3)
TCK_F: J11.4 R213.2 U2.L2(TCK)
TDI_F: J11.2 R212.2 U2.L5(TDI)
TDO_F: J11.3 U2.L4(TDO)
TMS_F: J11.5 R214.1 U2.L1(TMS)
VDD_24V_SYSTEM: DIPEX1.29 DIPEX2.30
Y17: U2.Y17(IO_B4___Y17/__DIFFIO_B48N/__DQS0B/CQ1B,CDPCLK3)
Y22: U2.Y22(IO_B5___Y22/__DIFFIO_R51N/__DQ3R)
NetAD_AIN_1: AD_AIN.1 R10AD.1
NetAD_AIN_2: AD_AIN.2 R11AD.1
NetAD_AIN_3: AD_AIN.3 R12AD.1
NetAD_AIN_4: AD_AIN.4 R13AD.1
NetAD_AIN_5: AD_AIN.5 R14AD.1
NetAD_AIN_6: AD_AIN.6 R15AD.1
NetAD_AIN_7: AD_AIN.7 R16AD.1
NetB2DA_2: B2DA.2 C7DA.1 U2DA.1(VDD)
NetC8DA_2: C8DA.2 C9DA.2 J2DA.1 R7DA.2 U3DA.1
NetLED11_1: LED11.1(A) R210.2
NetLED12_1: LED12.1(A) R211.2
NetR3AD_2: R3AD.2 U1AD.9(COM)
NetR6DA_1: R6DA.1 R7DA.1 U3DA.2
NetR7AD_2: R7AD.2 U1AD.16(BUSY)
NetR8AD_2: R8AD.2 U1AD.15(DOUT)
NetR215_2: R215.2 U4.2(Q)
NetR219_2: R219.2 U2.K6(NSTATUS)
NetR542_1: R542.1 U2.V2(IO_B2___V2/__DIFFIO_L38P/__DQ3L)
NetR1248_2: R1248.2 R1250.1
NetR1249_1: R1249.1 R1292.2 RT11.1
NetR1249_2: R1249.2 R1263.1 U148.2(INPUT1-)
NetR1250_2: R1250.2 U148.3(INPUT1+)
NetR1252_1: R1252.1 R1263.2 U148.1(OUTPUT1)
NetR1256_2: R1256.2 R1259.1 RT12.1
NetR1258_2: R1258.2 R1260.1
NetR2248_2: R2248.2 R2250.1
NetR2249_1: R2249.1 R2292.2 RT21.1
NetR2249_2: R2249.2 R2263.1 U247.2(INPUT1-)
NetR2250_2: R2250.2 U247.3(INPUT1+)
NetR2252_1: R2252.1 R2263.2 U247.1(OUTPUT1)
NetR2256_2: R2256.2 R2259.1 RT22.1
NetR2258_2: R2258.2 R2260.1
NetT1_1: T1.1 U2.T21(CLK6___T21/__DIFFCLK_3P)
NetT2_1: T2.1 U2.AA21(IO_B5___AA21/__DIFFIO_R56P/__DM3R/BWS#3R)
NetT12_1: T12.1 U2.Y3(IO_B3___Y3/__DIFFIO_B4P/__DQ3B)
NetT13_1: T13.1 U2.Y4(VREFB3N3)

Not connected (* = marked no-connect by the designer): U2 A3(IO_B8___A3/__DIFFIO_T4N/__DATA10/__DQ3T) B7(IO_B8___B7/__DIFFIO_T19P/__DATA4/__DQ5T) C3(IO_B8___C3/__DIFFIO_T3N/__DQ3T) C4(IO_B8___C4/__DIFFIO_T3P/__DATA12/__DQS1T/CQ1T#,CDPCLK7) C10(VREFB8N0) C13(IO_B7___C13/__DIFFIO_T35N/__PADD7) D10(IO_B8___D10/__DIFFIO_T26N/__DQ5T) D13(IO_B7___D13/__DIFFIO_T35P/__PADD8/__DQ4T) E9(VREFB8N1) E11(IO_B7___E11/__DIFFIO_T27N/__PADD13) E12(IO_B7___E12/__DIFFIO_T28P) E13(VREFB7N3) F8(IO_B8___F8/__DIFFIO_T5N/__DATA9/__DQ3T) G11(IO_B8___G11/__DIFFIO_T22N) G13(IO_B7___G13/__DIFFIO_T42N) G14(IO_B7___G14/__DIFFIO_T44P) G15(IO_B7___G15/__DIFFIO_T49N) G16(IO_B7___G16/__DIFFIO_T50P) H6(IO_B1___H6/__DIFFIO_L9P/__DQ2L) H8(IO_B1___H8/__DIFFIO_L14P) H10(IO_B8___H10/__DIFFIO_T14P) H11(IO_B8___H11/__DIFFIO_T14N) H14(IO_B7___H14/__DIFFIO_T48P) H15(IO_B7___H15/__DIFFIO_T48N) H16(IO_B6___H16/__DIFFIO_R10P) J8(IO_B1___J8/__DIFFIO_L14N) L7(IO_B2___L7/__DIFFIO_L30N) L8(IO_B1___L8/__DIFFIO_L20P) M6(IO_B2___M6/__DIFFIO_L26N/__DQ0L) M7(IO_B2___M7/__DIFFIO_L41N) M8(IO_B2___M8/__DIFFIO_L42P) M16(VREFB5N0) N5(IO_B2___N5/__DQ1L) N6(IO_B2___N6/__DIFFIO_L41P/__DQ3L) N7(IO_B2___N7/__DIFFIO_L49P) N8(IO_B2___N8/__DIFFIO_L42N) N17(IO_B5___N17/__DIFFIO_R33N) N18(IO_B5___N18/__DIFFIO_R33P/__DQS1R/CQ1R#,DPCLK6) N19(IO_B5___N19/__DIFFIO_R36P) P3(IO_B2___P3/__DIFFIO_L34N/__DQ1L) P6(IO_B2___P6/__DIFFIO_L52P) P7(IO_B2___P7/__DIFFIO_L49N) P15(IO_B5___P15/__DIFFIO_R46N) P17(IO_B5___P17) R7(IO_B2___R7/__DIFFIO_L53P) R14(IO_B4___R14/__DIFFIO_B52P) T7(IO_B2___T7/__DIFFIO_L53N) T8(IO_B3___T8/__DIFFIO_B11P) T9(IO_B3___T9/__DIFFIO_B11N) T10(IO_B3___T10/__DIFFIO_B15P) T11(IO_B3___T11/__DIFFIO_B15N) T12(IO_B4___T12/__DIFFIO_B36P) T13(IO_B4___T13/__DIFFIO_B36N) T14(IO_B4___T14/__DIFFIO_B42P) T15(IO_B4___T15/__DIFFIO_B42N/__DQ2B) T16(IO_B4___T16/__PLL4_CLKOUTP) U8(IO_B3___U8/__DIFFIO_B3N) U9(IO_B3___U9/__DIFFIO_B13P/__DQ3B) U11(VREFB3N0) U12(IO_B4___U12/__DIFFIO_B34P/__DQ4B) U15(IO_B4___U15/__DIFFIO_B40P) U16(IO_B4___U16/__DIFFIO_B50P) V7(IO_B3___V7/__DIFFIO_B7N) V8(IO_B3___V8/__DIFFIO_B13N/__DQ3B) V9(VREFB3N1) V10(IO_B3___V10/__DIFFIO_B16P/__DQS3B/CQ3B#,DPCLK2) V11(IO_B3___V11/__DIFFIO_B25N/__DQ5B) V12(VREFB4N3) V13(IO_B4___V13/__DQS2B/CQ3B,DPCLK5) V14(IO_B4___V14/__DIFFIO_B39P/__DQ2B) V15(IO_B4___V15/__DIFFIO_B40N/__DQ2B) V16(VREFB4N0) W7(IO_B3___W7/__DIFFIO_B12P/__DQ3B) W8(IO_B3___W8/__DQ3B) W10(IO_B3___W10/__DIFFIO_B26P/__DQ5B) W13(IO_B4___W13/__DIFFIO_B32P/__DQ4B) W14(VREFB4N2) W15(IO_B4___W15/__DIFFIO_B41N/__DQ2B) W17(IO_B4___W17/__DIFFIO_B48P/__DQ2B) W19(VREFB5N3) Y6(IO_B3___Y6/__DIFFIO_B6P/__DQS1B/CQ1B#,CDPCLK2) Y7(IO_B3___Y7/__DIFFIO_B12N/__DQ3B) Y8(IO_B3___Y8/__DQ5B) Y10(IO_B3___Y10/__DIFFIO_B26N/__DQ5B) Y13(IO_B4___Y13/__DIFFIO_B32N/__DQS4B/CQ5B,DPCLK4); U2DA 3(OUTB) 4(OUTC) 6(OUTD)

## Notes on the sheet
- (near U2DA) 输出模似量0~2.5V
- 7-采样电压通过电阻分压实现
- 7-加入4路PT1000温度检测电路
- 从MINI移动过来的AD
- (in symbol EP4CE40F484, part A) EP4CE40F484 / VERSION : 1.0 / PAGE : 1 of  8 / DATE : MAY 2010 /
- (in symbol EP4CE40F484, part B) EP4CE40F484 / VERSION : 1.0 / PAGE : 2 of  8 / DATE : MAY 2010 /
- (in symbol EP4CE40F484, part C) EP4CE40F484 / VERSION : 1.0 / PAGE : 3 of  8 / DATE : MAY 2010 /
- (in symbol EP4CE40F484, part D) EP4CE40F484 / VERSION : 1.0 / PAGE : 4 of 8 / DATE : MAY 2010 /
- (in symbol EP4CE40F484, part E) EP4CE40F484 / VERSION : 1.0 / PAGE : 5 of 8 / DATE : MAY 2010 /
- (in symbol EP4CE40F484, part F) EP4CE40F484 / VERSION : 1.0 / PAGE : 6 of 8 / DATE : MAY 2010 /
- (in symbol EP4CE40F484, part G) EP4CE40F484 / VERSION : 1.0 / PAGE : 7 of 8 / DATE : MAY 2010 /
- (in symbol EP4CE40F484, part H) EP4CE40F484 / VERSION : 1.0 / PAGE : 8 of 8 / DATE : MAY 2010 /

## Library data of the parts
B2DA = FERRITE BEAD: Manufacturer PartNumber: MPZ1608S221A; Manufacturer: TDK; Remark: 磁珠
C1AD C2AD C3AD C4AD C5AD C6AD C7AD C8AD C9AD C10AD C11AD C12AD C13AD C14AD C15AD C16AD C17AD C18AD C171-C186 C188-C195 Ca170-Ca172 = C0603
C6DA C7DA C8DA C9DA C12DA = CAPACITOR NON-POL_Dup2: CAP .10UF 50V CERAMIC X7R; Manufacturer: Kemet; Manufacturers part Reference: C0603C104K5RACTU; ROHS STATUS: COMPLIANT; TEMPERATURE GRADE: -55 to +125; TEMP Grade: -55 to +125; MAKE: Kemet; Package: 0603
C215 = CAP
DIPEX1 = Header 17X2: Header, 17-Pin, Dual row; LatestRevisionDate: 17-Jul-2002; LatestRevisionNote: Re-released for DXP Platform.; Publisher: Altium Limited
DIPEX2 = Header 15X2: Header, 15-Pin, Dual row; LatestRevisionDate: 17-Jul-2002; LatestRevisionNote: Re-released for DXP Platform.; Publisher: Altium Limited
J2DA = CON3
J11 = HEAD5_1.27
R1AD R2AD R3AD R4AD R4DA R5AD R5DA R6AD R6DA R7AD R7DA R8AD R8DA R9AD R10AD R11AD R12AD R13AD R14AD R15AD R16AD R17AD R18AD R19AD R20AD R21AD R22AD R23AD R151AD R210-R219 R542 R1247-R1250 R1252 R1256-R1260 R1262-R1264 R1292 R2247-R2250 R2252 R2256-R2260 R2262-R2264 R2292 RT11 RT12 RT21 RT22 = RES
U2 = EP4CE40F484: SWAP_INFO: (S1+S2+S3+S4+S5+S6+S7+S8); SPLIT_INST: TRUE
U3DA = OPAMP: 运算放大器
U4 = MP25P16
U148 U247 = 4580
U252 = LM1117